# Altium schematic sheet CanRotor_Mini(1).SchDoc: CanRotor_Mini
size A4; Author: WHS; Organization: 깡통로봇연구소; Address1: Korea; Address2: Gwangju; Address3: Cafe; Revision: 7.0; SheetNumber: 1; SheetTotal: 2; ProjectName: CanRotor_Mini
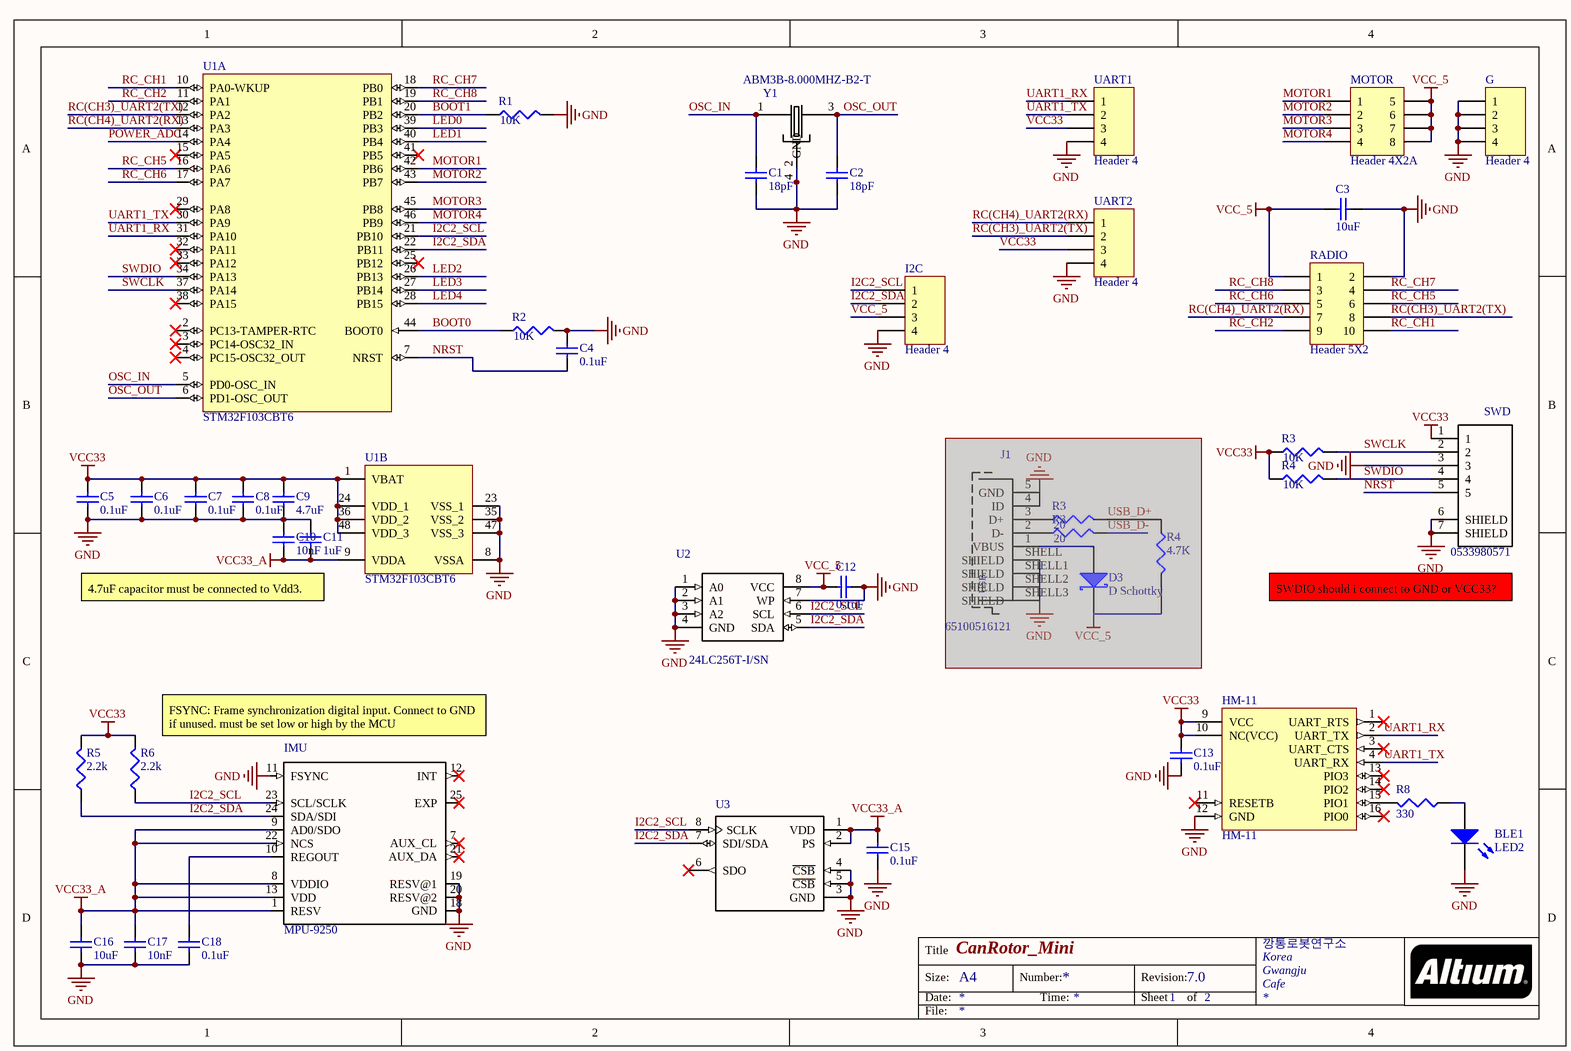
[diagram p0: CanRotor_Mini(1).SchDoc]

## Parts
(Parts that share a designator on the sheet are numbered #1, #2 ... from top to bottom, then left to right.)
BLE1  LED2  [LED0603]
C1  value 18pF  [1608[0603]]  (hidden comment: Cap Semi)
C2  value 18pF  [1608[0603]]  (hidden comment: Cap Semi)
C3  value 10uF  [6-0805_L]  (hidden comment: Cap Semi)
C4  value 0.1uF  [1608[0603]]  (hidden comment: Cap Semi)
C5  value 0.1uF  [1608[0603]]  (hidden comment: Cap Semi)
C6  value 0.1uF  [1608[0603]]  (hidden comment: Cap Semi)
C7  value 0.1uF  [1608[0603]]  (hidden comment: Cap Semi)
C8  value 0.1uF  [1608[0603]]  (hidden comment: Cap Semi)
C9  value 4.7uF  [6-0805_L]  (hidden comment: Cap Semi)
C10  value 10nF  [1608[0603]]  (hidden comment: Cap Semi)
C11  value 1uF  [1608[0603]]  (hidden comment: Cap Semi)
C12  value 0.1uF  [1608[0603]]  (hidden comment: Cap Semi)
C13  value 0.1uF  [1608[0603]]  (hidden comment: Cap Semi)
C15  value 0.1uF  [1608[0603]]  (hidden comment: Cap Semi)
C16  value 10uF  [6-0805_L]  (hidden comment: Cap Semi)
C17  value 10nF  [1608[0603]]  (hidden comment: Cap Semi)
C18  value 0.1uF  [1608[0603]]  (hidden comment: Cap Semi)
D3  D Schottky  [J1-0603]  (masked out: inside a compile mask, not in the netlist)
G  Header 4  [HDR1X4]
HM-11  HM-11  [HM-11]
I2C  Header 4  [HDR1X4]
IMU  MPU-9250  [QFN40P300X300X105-25N]
J1  65100516121  [65100516121_65100516121(Primary)]  (masked out: inside a compile mask, not in the netlist)
MOTOR  Header 4X2A  [HDR2X4_CEN]
R1  value 10K  [J1-0603]  (hidden comment: Res3)
R2  value 10K  [J1-0603]  (hidden comment: Res3)
R3#1  value 10K  [J1-0603]  (hidden comment: Res3)
R3#2  value 20  [J1-0603]  (hidden comment: Res3)  (masked out: inside a compile mask, not in the netlist)
R3#3  value 20  [J1-0603]  (hidden comment: Res3)  (masked out: inside a compile mask, not in the netlist)
R4#1  value 10K  [J1-0603]  (hidden comment: Res3)
R4#2  value 4.7K  [J1-0603]  (hidden comment: Res3)  (masked out: inside a compile mask, not in the netlist)
R5  value 2.2k  [J1-0603]  (hidden comment: Res3)
R6  value 2.2k  [J1-0603]  (hidden comment: Res3)
R8  value 330  [J1-0603]  (hidden comment: Res3)
RADIO  Header 5X2  [HDR2X5]
SWD  0533980571  [MOLEX_0533980571_0533980571(Primary)]
U1  STM32F103CBT6  [STM-LQFP48_N]  (parts A,B of 2)
U2  24LC256T-I/SN  [SOIC127P600X175-8N]
U3  MS561101BA03-50  [SON125P500X300X100-8N]  (value not drawn)
UART1  Header 4  [HDR1X4]
UART2  Header 4  [HDR1X4]
Y1  ABM3B-8.000MHZ-B2-T  [OSCSC500X320X110-4N]

## Nets
GND: BLE1.2(K) C1.1 C2.1 C3.2 C4.2 C5.1 C6.1 C7.1 C8.1 C9.2 C10.1 C11.1 C12.1 C13.1 C15.1 C16.1 C17.1 C18.1 G.1 G.2 G.3 G.4 HM-11.12(GND) I2C.4 IMU.11(FSYNC) IMU.18(GND) IMU.19(RESV@1) IMU.20(RESV@2) R1.2 R2.2 RADIO.2 SWD.3 SWD.6(SHIELD) SWD.7(SHIELD) U1.8(VSSA) U1.23(VSS_1) U1.35(VSS_2) U1.47(VSS_3) U2.1(A0) U2.2(A1) U2.3(A2) U2.4(GND) U2.7(WP) U3.3(GND) U3.4(~{CSB}) U3.5(~{CSB}) UART1.4 UART2.4 Y1.2(GND) Y1.4(GND)
VCC33: C5.2 C6.2 C7.2 C8.2 C9.1 C13.2 HM-11.9(VCC) HM-11.10(NC(VCC)) R3#1.1 R4#1.1 R5.2 R6.2 SWD.1 U1.1(VBAT) U1.24(VDD_1) U1.36(VDD_2) U1.48(VDD_3) UART1.3 UART2.3
VCC33_A: C10.2 C11.2 C15.2 C16.2 C17.2 IMU.1(RESV) IMU.8(VDDIO) IMU.9(AD0/SDO) IMU.13(VDD) IMU.22(NCS) U1.9(VDDA) U3.1(VDD) U3.2(PS)
VCC_5: C3.1 C12.2 I2C.3 MOTOR.5 MOTOR.6 MOTOR.7 MOTOR.8 RADIO.1 U2.8(VCC)
BOOT0: R2.1 U1.44(BOOT0)
BOOT1: R1.1 U1.20(PB2)
I2C2_SCL: I2C.1 IMU.23(SCL/SCLK) R6.1 U1.21(PB10) U2.6(SCL) U3.8(SCLK)
I2C2_SDA: I2C.2 IMU.24(SDA/SDI) R5.1 U1.22(PB11) U2.5(SDA) U3.7(SDI/SDA)
LED0: U1.39(PB3)
LED1: U1.40(PB4)
LED2: U1.26(PB13)
LED3: U1.27(PB14)
LED4: U1.28(PB15)
MOTOR1: MOTOR.1 U1.42(PB6)
MOTOR2: MOTOR.2 U1.43(PB7)
MOTOR3: MOTOR.3 U1.45(PB8)
MOTOR4: MOTOR.4 U1.46(PB9)
NRST: C4.1 SWD.5 U1.7(NRST)
OSC_IN: C1.2 U1.5(PD0-OSC_IN) Y1.1
OSC_OUT: C2.2 U1.6(PD1-OSC_OUT) Y1.3
POWER_ADC: U1.14(PA4)
RC(CH3)_UART2(TX): RADIO.8 U1.12(PA2) UART2.2
RC(CH4)_UART2(RX): RADIO.7 U1.13(PA3) UART2.1
RC_CH1: RADIO.10 U1.10(PA0-WKUP)
RC_CH2: RADIO.9 U1.11(PA1)
RC_CH5: RADIO.6 U1.16(PA6)
RC_CH6: RADIO.5 U1.17(PA7)
RC_CH7: RADIO.4 U1.18(PB0)
RC_CH8: RADIO.3 U1.19(PB1)
SWCLK: R3#1.2 SWD.2 U1.37(PA14)
SWDIO: R4#1.2 SWD.4 U1.34(PA13)
UART1_RX: HM-11.2(UART_TX) U1.31(PA10) UART1.1
UART1_TX: HM-11.4(UART_RX) U1.30(PA9) UART1.2
NetBLE1_1: BLE1.1(A) R8.1
NetC18_2: C18.2 IMU.10(REGOUT)
NetHM-11_15: HM-11.15(PIO1) R8.2

Not connected (* = marked no-connect by the designer): HM-11 1(UART_RTS)* 3(UART_CTS)* 11(RESETB)* 13(PIO3)* 14(PIO2)* 16(PIO0)*; IMU 7(AUX_CL)* 12(INT)* 21(AUX_DA)* 25(EXP)*; U1 2(PC13-TAMPER-RTC)* 3(PC14-OSC32_IN)* 4(PC15-OSC32_OUT)* 15(PA5)* 25(PB12)* 29(PA8)* 32(PA11)* 33(PA12)* 38(PA15)* 41(PB5)*; U3 6(SDO)*

## Notes on the sheet
- 4.7uF capacitor must be connected to Vdd3.
- (near SWD) SWDIO should i connect to GND or VCC33?
- FSYNC: Frame synchronization digital input. Connect to GND if unused. must be set low or high by the MCU
- Title
- Size:
- Date:
- A4
- Number:
- Time:
- Revision:
- Sheet
- of
- File:
- (in symbol 65100516121) USB

## Library data of the parts
BLE1 = LED2: Typical RED, GREEN, YELLOW, AMBER GaAs LED; Published: 8-Jun-2000; LatestRevisionDate: 17-Jul-2002; LatestRevisionNote: Re-released for DXP Platform.; PackageVersion: Feb-2002; PackageReference: 3.2X1.6X1.1; Publisher: Altium Limited; PackageDescription: SM LED; 2 Flat Leads
C1-C13 C15-C18 = Cap Semi: Capacitor (Semiconductor SIM Model); Published: 8-Jun-2000; LatestRevisionDate: 29-May-2009; LatestRevisionNote: IPC-7351 Footprint Added.; PackageReference: C1206; Publisher: Altium Limited; PackageDescription: Chip Capacitor
D3 = D Schottky: Schottky Diode; Published: 8-Jun-2000; LatestRevisionDate: 17-Jul-2002; LatestRevisionNote: Re-released for DXP Platform.; PackageReference: SMB; Publisher: Altium Limited; PackageDescription: DO-214-AA/SMB; 2 C-Bend Leads; Body 5.3 x 3.6 mm, inc. leads (LxW); Code_JEDEC: DO-214-AA
G I2C UART1 UART2 = Header 4: Header, 4-Pin; LatestRevisionDate: 17-Jul-2002; LatestRevisionNote: Re-released for DXP Platform.; Publisher: Altium Limited
IMU = MPU-9250: SMD Gyroscope/Accelerometer/Magnetometer Sensor%3B 9-AXIS; MF: InvenSense; Package: QFN-24 InvenSense; Price: 6.07 USD; MP: MPU-9250; Availability: Warning; Value: *
J1 = 65100516121: WR-COM Series Right Angle SMT Type B Mini USB Connector Receptacle, 30 V ac, 1A; MF: W체rth Elektronik; MP: 65100516121; Package: None; Price: 1.07 USD; Availability: Good; Value: *
MOTOR = Header 4X2A: Header, 4-Pin, Dual row; LatestRevisionDate: 17-Jul-2002; LatestRevisionNote: Re-released for DXP Platform.; Publisher: Altium Limited
R1 R2 R3#1-R3#3 R4#1 R4#2 R5 R6 R8 = Res3: Resistor; Published: 8-Jun-2000; LatestRevisionDate: 29-May-2009; LatestRevisionNote: IPC-7351 Footprint Added.; PackageReference: J1-0603; Publisher: Altium Limited; PackageDescription: Chip Resistor
RADIO = Header 5X2: Header, 5-Pin, Dual row; LatestRevisionDate: 17-Jul-2002; LatestRevisionNote: Re-released for DXP Platform.; Publisher: Altium Limited
SWD = 0533980571: Conn Shrouded Header HDR 5 POS 1.25mm Solder ST SMD PicoBlade횄짖창?혷횂짖 Embossed T/R; MF: Molex, LLC; SnapEDA_Link: https://www.snapeda.com/parts/0533980571/Molex%2C%20LLC/view-part/?ref=snap; Package: None; MP: 0533980571; Availability: Unavailable; Price: None; Value: *
U1 = STM32F103CBT6: ARM Cortex-M3 32-bit MCU, 128 KB Flash, 20 KB Internal RAM, 37 I/Os, 48-pin LQFP, -40 to 85 degC, Tray; A/D Converter: 2x12-bit (10 Channel); FLASH Size (Prog) (kB): 128; I/Os (High Current): 37; Internal RAM Size (kB): 20; Operating Frequency(F) (Processor speed) (MHz): 72; Supply Voltage(Vcc) min (V): 2; DatasheetVersion: Rev. 16; PackageVersion: Rev. 6, 06/2013; PackageReference: LQFP48; PackageDescription: 48-Pin Low Profile Quad Flat Package, 7 x 7 mm Body, 0.5 mm Pitch; Supplier 1: Digi-Key; Supplier Part Number 1: 497-6288-ND; Supplier 2: Farnell; Supplier Part Number 2: 1606327; Supplier 3: Newark; Supplier Part Number 3: 11N8296; Supplier 4: Newark; Supplier Part Number 4: 57P1214; Supplier 5: Mouser; Supplier Part Number 5: 511-STM32F103CBT6; Core: ARM Cortex-M3; Packing: Tray; Mounting Technology: Surface Mount; PartNumber: STM32F103CBT6; ComponentLink1Description: Manufacturer URL; ComponentLink1URL: http://www.st.com/web/en/home.html; ComponentLink2Description: Datasheet; ComponentLink2URL: http://www.st.com/st-web-ui/static/active/en/resource/technical/document/datasheet/CD00161566.pdf; ComponentLink3Description: Package Specification; ComponentLink3URL: http://www.st.com/st-web-ui/static/active/en/resource/technical/document/datasheet/DM00058181.pdf
U2 = 24LC256T-I/SN: EEPROM Serial-I2C 256K-bit 32K x 8 3.3V/5V 8-Pin SOIC N T/R; MF: Microchip; SnapEDA_Link: https://www.snapeda.com/parts/24LC256T-I/SN/Microchip/view-part/?ref=snap; Package: SOIC-8 Microchip; MP: 24LC256T-I/SN; Availability: Unavailable; Price: None; Value: *
U3 = MS561101BA03-50: Pressure Sensor 1.44V to 3.6V 0.01bar to 1.2bar Absolute 8-Pin QFN T/R; MF: TE Connectivity; Availability: Unavailable; MP: MS561101BA03-50; Package: SMD-8 Measurement Specialties; SnapEDA_Link: https://www.snapeda.com/parts/MS561101BA03-50/TE%20Connectivity%20ALCOSWITCH%20Switches/view-part/?ref=snap; TE_purchase_URL: https://www.te.com/usa-en/product-MS561101BA03-50.html?te_bu=Cor&te_type=disp&te_campaign=seda_glo_cor-seda-global-disp-prtnr-fy19-seda-model-bom-cta_sma-317_1&elqCampaignId=32493; Price: None; Value: *
Y1 = ABM3B-8.000MHZ-B2-T: Crystal 8MHz %C2%B120ppm %28Tol%29 %C2%B150ppm %28Stability%29 18pF FUND 200Ohm 4-Pin CSMD T/R; MF: Abracon; MP: ABM3B-8.000MHZ-B2-T; Package: 5.0 x 3.2mm Abracon; Price: 0.47 USD; Availability: Good; Value: *